# Altium project NeoM8P_GPS.PrjPcb
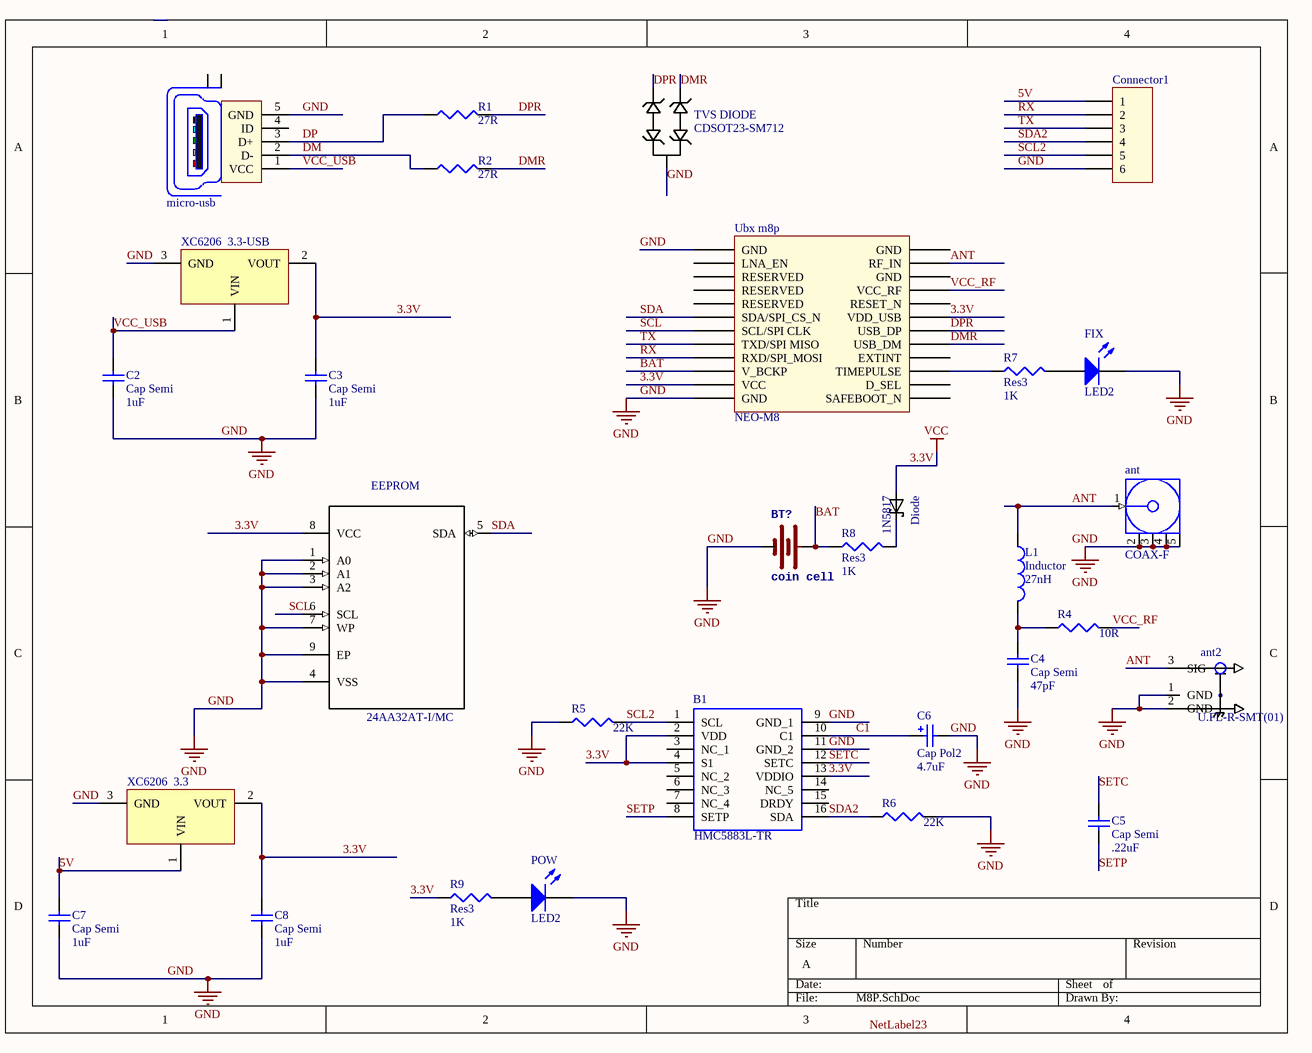
[diagram p0: M8P.SchDoc]
1 sheet, 30 parts. Net scope: global (net labels, ports and power ports of the same name join across sheets).
Board file: M8P.PcbDoc

## Sheet M8P.SchDoc
size A

### Parts
ant  COAX-F  [MCX5.08-H5]
ant2  U.FL-R-SMT(01)  [HRS_U.FL-R-SMT(01)]
B1  HMC5883L-TR  [16-PIN-LPCC]
Bat  coin cell  [BATTCON-6.8MM]
C2  Cap Semi  value 1uF  [1608[0603]]
C3  Cap Semi  value 1uF  [1608[0603]]
C4  Cap Semi  value 47pF  [1608[0603]]
C5  Cap Semi  value .22uF  [1608[0603]]
C6  Cap Pol2  value 4.7uF  [1608[0603]]
C7  Cap Semi  value 1uF  [1608[0603]]
C8  Cap Semi  value 1uF  [1608[0603]]
Connector1  653006117322  [653006117322]  (value not drawn)
Diode  1N5817  [DO214AC_SS12(Primary)]
EEPROM  24AA32AT-I/MC  [DFN200X300X100-9N]
FIX  LED2  [J1-0603]
L1  Inductor  value 27nH  [1608[0603]]
micro-usb  WR-Communication Connectors 629105150921  [629105150921]  (value not drawn)
POW  LED2  [J1-0603]
R1  value 27R  [J1-0603]  (hidden comment: RES)
R2  27R  [J1-0603]
R4  value 10R  [J1-0603]  (hidden comment: Res3)
R5  value 22K  [J1-0603]  (hidden comment: Res3)
R6  value 22K  [J1-0603]  (hidden comment: Res3)
R7  Res3  value 1K  [J1-0603]
R8  Res3  value 1K  [J1-0603]
R9  Res3  value 1K  [J1-0603]
TVS_DIODE  CDSOT23-SM712  [SOT-23-3]
Ubx_m8p  NEO-M8  [NEO]
XC6206_3.3  AMS1117-3.3  [SOT23_M]  (value not drawn)
XC6206_3.3-USB  AMS1117-3.3  [SOT23_M]  (value not drawn)

### Nets
3.3V: B1.2(VDD) B1.4(S1) B1.13(VDDIO) C3.1 C8.1 Diode.A EEPROM.8(VCC) R9.1 Ubx_m8p.7(VDD_USB) Ubx_m8p.23(VCC) XC6206_3.3.2(VOUT) XC6206_3.3-USB.2(VOUT)  [also labelled VCC]
GND: ant.2(GND) ant.3(GND) ant.4(GND) ant.5(GND) ant2.1(GND) ant2.2(GND) B1.9(GND_1) B1.11(GND_2) Bat.- C2.2 C3.2 C4.2 C6.2 C7.2 C8.2 Connector1.6 EEPROM.1(A0) EEPROM.2(A1) EEPROM.3(A2) EEPROM.4(VSS) EEPROM.7(WP) EEPROM.9(EP) FIX.2(K) micro-usb.5(GND) POW.2(K) R5.1 R6.2 TVS_DIODE.3(GND) Ubx_m8p.13(GND) Ubx_m8p.24(GND) XC6206_3.3.3(GND) XC6206_3.3-USB.3(GND)
5V: C7.1 Connector1.1 XC6206_3.3.1(VIN)
ANT: ant.1(Signal) ant2.3(SIG) L1.1 Ubx_m8p.11(RF_IN)
BAT: Bat.+ R8.1 Ubx_m8p.22(V_BCKP)
C1: B1.10(C1) C6.1
DM: micro-usb.2(D-) R2.1
DMR: R2.2 TVS_DIODE.2(IO2) Ubx_m8p.5(USB_DM)
DP: micro-usb.3(D+) R1.1
DPR: R1.2 TVS_DIODE.1(IO1) Ubx_m8p.6(USB_DP)
RX: Connector1.2 Ubx_m8p.21(RXD/SPI_MOSI)
SCL: EEPROM.6(SCL) Ubx_m8p.19(SCL/SPI_CLK)
SCL2: B1.1(SCL) Connector1.5 R5.2
SDA: EEPROM.5(SDA) Ubx_m8p.18(SDA/SPI_CS_N)
SDA2: B1.16(SDA) Connector1.4 R6.1
SETC: B1.12(SETC) C5.1
SETP: B1.8(SETP) C5.2
TX: Connector1.3 Ubx_m8p.20(TXD/SPI_MISO)
VCC_RF: R4.2 Ubx_m8p.9(VCC_RF)
VCC_USB: C2.1 micro-usb.1(VCC) XC6206_3.3-USB.1(VIN)
NetC4_1: C4.1 L1.2 R4.1
NetDiode_C: Diode.C R8.2
NetFIX_1: FIX.1(A) R7.2
NetPOW_1: POW.1(A) R9.2
NetR7_1: R7.1 Ubx_m8p.3(TIMEPULSE)

Not connected (* = marked no-connect by the designer): B1 3(NC_1) 5(NC_2) 6(NC_3) 7(NC_4) 14(NC_5) 15(DRDY); micro-usb 4(ID) Z1(Shield) Z2(Shield); Ubx_m8p 1(SAFEBOOT_N) 2(D_SEL) 4(EXTINT) 8(RESET_N) 10(GND) 12(GND) 14(LNA_EN) 15(RESERVED) 16(RESERVED) 17(RESERVED)

### Notes on the sheet
- Labels drawn without touching a wire or pin: GND, NetLabel23

### Library data of the parts
ant = COAX-F: RF Coaxial PCB Connector, MCX; Thru-Hole, Right-Angle Mount Socket, Blunt Post Terminal, 50 Ohm Impedance; PCB_Layout: Complies with manufacturer's recommendation.; DrillSize: Corresponds to nominal value.; Published: 15-Jul-2004; LatestRevisionDate: 15-Jul-2004; LatestRevisionNote: Component Replaced.; DatasheetDocument: 30-May-2003; PackageDocument: 04-Jul-1999; PackageReference: 919-119J-51AX; Publisher: Altium Limited; ComponentLink1Description: Manufacturer Link; ComponentLink1URL: http://www.amphenolrf.com/
ant2 = U.FL-R-SMT(01): U.FL Series 6 Ghz 50 Ohm Ultra-small SMT Coaxial Cable Receptacle; MF: Hirose; MP: U.FL-R-SMT_01_; Price: None; Package: None; Availability: Unavailable; SnapEDA_Link: https://www.snapeda.com/parts/U.FL-R-SMT%2801%29/Hirose%20Electric%20Co%20Ltd/view-part/?ref=snap; Value: *
B1 = HMC5883L-TR: HONEYWELL - HMC5883L-TR - IC, DIGITAL COMPASS, 3 AXIS, 16 PIN; Manufacturer_Name: Honeywell; Manufacturer_Part_Number: HMC5883L-TR; RS Part Number: *; RS Price/Stock: *; Arrow Part Number: HMC5883L-TR; Arrow Price/Stock: *; Datasheet Link: http://www.farnell.com/datasheets/2156842.pdf
Bat = BATTERY-6.8MM_SMD: PROD_ID: BATT-13734
C2-C5 C7 C8 = Cap Semi: Capacitor (Semiconductor SIM Model); Published: 8-Jun-2000; LatestRevisionDate: 29-May-2009; LatestRevisionNote: IPC-7351 Footprint Added.; PackageReference: C1206; Publisher: Altium Limited; PackageDescription: Chip Capacitor
C6 = Cap Pol2: Polarized Capacitor (Axial); Published: 8-Jun-2000; LatestRevisionDate: 17-Jul-2002; LatestRevisionNote: Re-released for DXP Platform.; PackageReference: POLAR0.8; Publisher: Altium Limited; PackageDescription: Polarized Capacitor; 2 Leads
Connector1 = 653006117322: WR-WTB 1.25mm Male Horizontal Shrouded Header, 6p; Pin Number: 6; ComponentLink1Description: Manufacturer; ComponentLink1URL: http://www.we-online.de; ComponentLink2Description: Datasheet; ComponentLink2URL: http://katalog.we-online.de/em/datasheet/6530xx117322.pdf; Part Number: 653006117322; Published Date: June 2017; Publisher: Wurth Elektronik; Pitch: 1.25 mm
Diode = SS12: Diode, Schottk, Rectif, 1a, 20v, Sma; MF: ON Semiconductor; Availability: Unavailable; MP: SS12; SnapEDA_Link: https://www.snapeda.com/parts/SS12/ON%20Semiconductor/view-part/?ref=snap; Price: None; Package: DO-214AC-214 ON Semiconductor; Value: *
EEPROM = 24AA32AT-I/MC: 24AA32A Series 32 K _4 K X 8_ 5.5 V Serial Surface Mount EEPROM - DFN-8; MF: Microchip; SnapEDA_Link: https://www.snapeda.com/parts/24AA32AT-I/MC/Microchip/view-part/?ref=snap; Availability: Unavailable; Package: DFN-8 Microchip; Price: None; MP: 24AA32AT-I/MC; Value: *
FIX POW = LED2: Typical RED, GREEN, YELLOW, AMBER GaAs LED; Published: 8-Jun-2000; LatestRevisionDate: 17-Jul-2002; LatestRevisionNote: Re-released for DXP Platform.; PackageVersion: Feb-2002; PackageReference: 3.2X1.6X1.1; Publisher: Altium Limited; PackageDescription: SM LED; 2 Flat Leads
L1 = Inductor: Code_IEC: 1005; Published: 8-Jun-2000; LatestRevisionDate: 29-May-2009; LatestRevisionNote: IPC-7351 Footprint Added.; PackageReference: 0402-A; Publisher: Altium Limited; PackageDescription: Chip Inductor; Code_JEITA: 0402
micro-usb = WR-Communication Connectors 629105150921: WR-COM_USB_Micro Type AB_Horizontal_SMT; Manufacturer: Würth Elektronik eiSos GmbH; ComponentLink1 Description: Manufacturer; ComponentLink2 Description: Datasheet; NoPins: 5; ComponentLink1URL: http://www.we-online.de; ComponentLink2URL: http://katalog.we-online.de/em/datasheet/629105150921.pdf; Created by: Karrer Zheng; Created Date: 10/23/2014; partNo: 629105150921
R1 R2 R4-R9 = Res3: Resistor; Published: 8-Jun-2000; LatestRevisionDate: 29-May-2009; LatestRevisionNote: IPC-7351 Footprint Added.; PackageReference: J1-0603; Publisher: Altium Limited; PackageDescription: Chip Resistor
  R2: Value: 27R
TVS_DIODE = CDSOT23-SM712: Diode, Smt Tvs Array, 7vrwm & 12vrwm, Sot23 Package; MF: Bourns; Price: None; Package: SOT-23 Bourns; Availability: Unavailable; SnapEDA_Link: https://www.snapeda.com/parts/CDSOT23-SM712/Bourns%20-%20J.W.%20Miller/view-part/?ref=snap; MP: CDSOT23-SM712; Value: *
Ubx_m8p = NEO: u-blox NEO GNSS module; Part Description: u-blox GNSS module; Manufacturer: u-blox; Value: NEO-M8
XC6206_3.3 XC6206_3.3-USB = AMS1117-3.3: 3.3V  3-Terminal Adjustable Positive Voltage Regulator